# EAGLE design master_camera_io_2 (EAGLE 9.6.2)
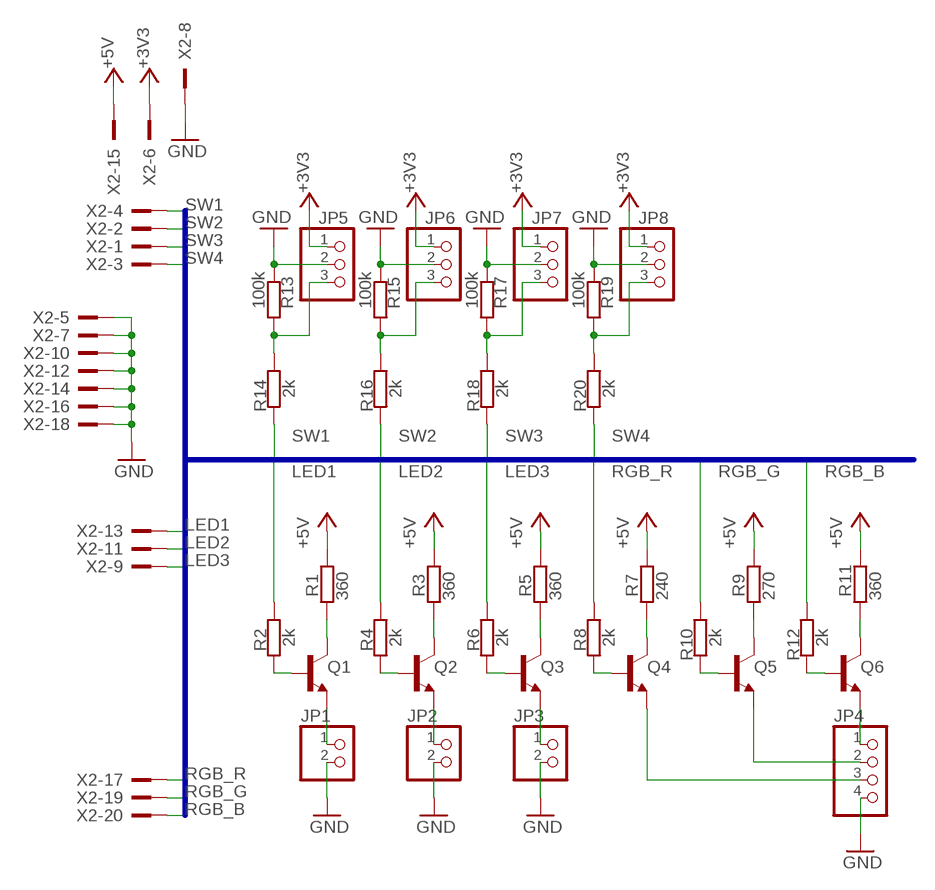
[diagram p0: schematic, sheet 1]

## Parts
JP1  PINHD-1X2  [1X02]
JP2  PINHD-1X2  [1X02]
JP3  PINHD-1X2  [1X02]
JP4  PINHD-1X4  [1X04]
JP5  PINHD-1X3  [1X03]
JP6  PINHD-1X3  [1X03]
JP7  PINHD-1X3  [1X03]
JP8  PINHD-1X3  [1X03]
Q1  BC850SMD  [SOT23-BEC]
Q2  BC850SMD  [SOT23-BEC]
Q3  BC850SMD  [SOT23-BEC]
Q4  BC850SMD  [SOT23-BEC]
Q5  BC850SMD  [SOT23-BEC]
Q6  BC850SMD  [SOT23-BEC]
R1  360  R-EU_R0805  [R0805]
R2  2k  R-EU_R0805  [R0805]
R3  360  R-EU_R0805  [R0805]
R4  2k  R-EU_R0805  [R0805]
R5  360  R-EU_R0805  [R0805]
R6  2k  R-EU_R0805  [R0805]
R7  240  R-EU_R0805  [R0805]
R8  2k  R-EU_R0805  [R0805]
R9  270  R-EU_R0805  [R0805]
R10  2k  R-EU_R0805  [R0805]
R11  360  R-EU_R0805  [R0805]
R12  2k  R-EU_R0805  [R0805]
R13  100k  R-EU_R0805  [R0805]
R14  2k  R-EU_R0805  [R0805]
R15  100k  R-EU_R0805  [R0805]
R16  2k  R-EU_R0805  [R0805]
R17  100k  R-EU_R0805  [R0805]
R18  2k  R-EU_R0805  [R0805]
R19  100k  R-EU_R0805  [R0805]
R20  2k  R-EU_R0805  [R0805]
X2  2520-  [PAK100/2500-20]

## Nets
+3V3: JP5.1 JP6.1 JP7.1 JP8.1 X2.6
+5V: R1.2 R3.2 R5.2 R7.2 R9.2 R11.2 X2.15
GND: JP1.2 JP2.2 JP3.2 JP4.4 JP5.2 JP6.2 JP7.2 JP8.2 R13.2 R15.2 R17.2 R19.2 X2.5 X2.7 X2.8 X2.10 X2.12 X2.14 X2.16 X2.18
LED1: R2.1 X2.13
LED2: R4.1 X2.11
LED3: R6.1 X2.9
N$1: JP1.1 Q1.E
N$2: Q1.B R2.2
N$3: Q1.C R1.1
N$4: JP2.1 Q2.E
N$5: Q2.B R4.2
N$6: Q2.C R3.1
N$7: JP3.1 Q3.E
N$8: Q3.B R6.2
N$9: Q3.C R5.1
N$10: JP4.1 Q6.E
N$11: Q4.B R8.2
N$12: Q4.C R7.1
N$13: JP4.2 Q5.E
N$14: Q5.B R10.2
N$15: Q5.C R9.1
N$16: JP4.3 Q4.E
N$17: Q6.B R12.2
N$18: Q6.C R11.1
N$19: JP5.3 R13.1 R14.1
N$20: JP6.3 R15.1 R16.1
N$21: JP7.3 R17.1 R18.1
N$22: JP8.3 R19.1 R20.1
RGB_B: R12.1 X2.20
RGB_G: R10.1 X2.19
RGB_R: R8.1 X2.17
SW1: R14.2 X2.4
SW2: R16.2 X2.2
SW3: R18.2 X2.1
SW4: R20.2 X2.3

## Buses
LED1,LED2,LED3,RGB_B,RGB_G,RGB_R,SW1,SW2,SW3,SW4

## Library data of the parts
JP1-JP3 = pinhead:PINHD-1X2: PIN HEADER
JP4 = pinhead:PINHD-1X4: PIN HEADER
JP5-JP8 = pinhead:PINHD-1X3: PIN HEADER
Q1-Q6 = transistor-npn:BC850*: NPN Transistor
R1-R20 = rcl:R-EU_: RESISTOR, European symbol; SPICEPREFIX: R
X2 = con-3m:2520-: 3M (TM) Pak 100 4-Wall Header Source: 3M; OC_FARNELL: unknown; OC_NEWARK: unknown

## Board
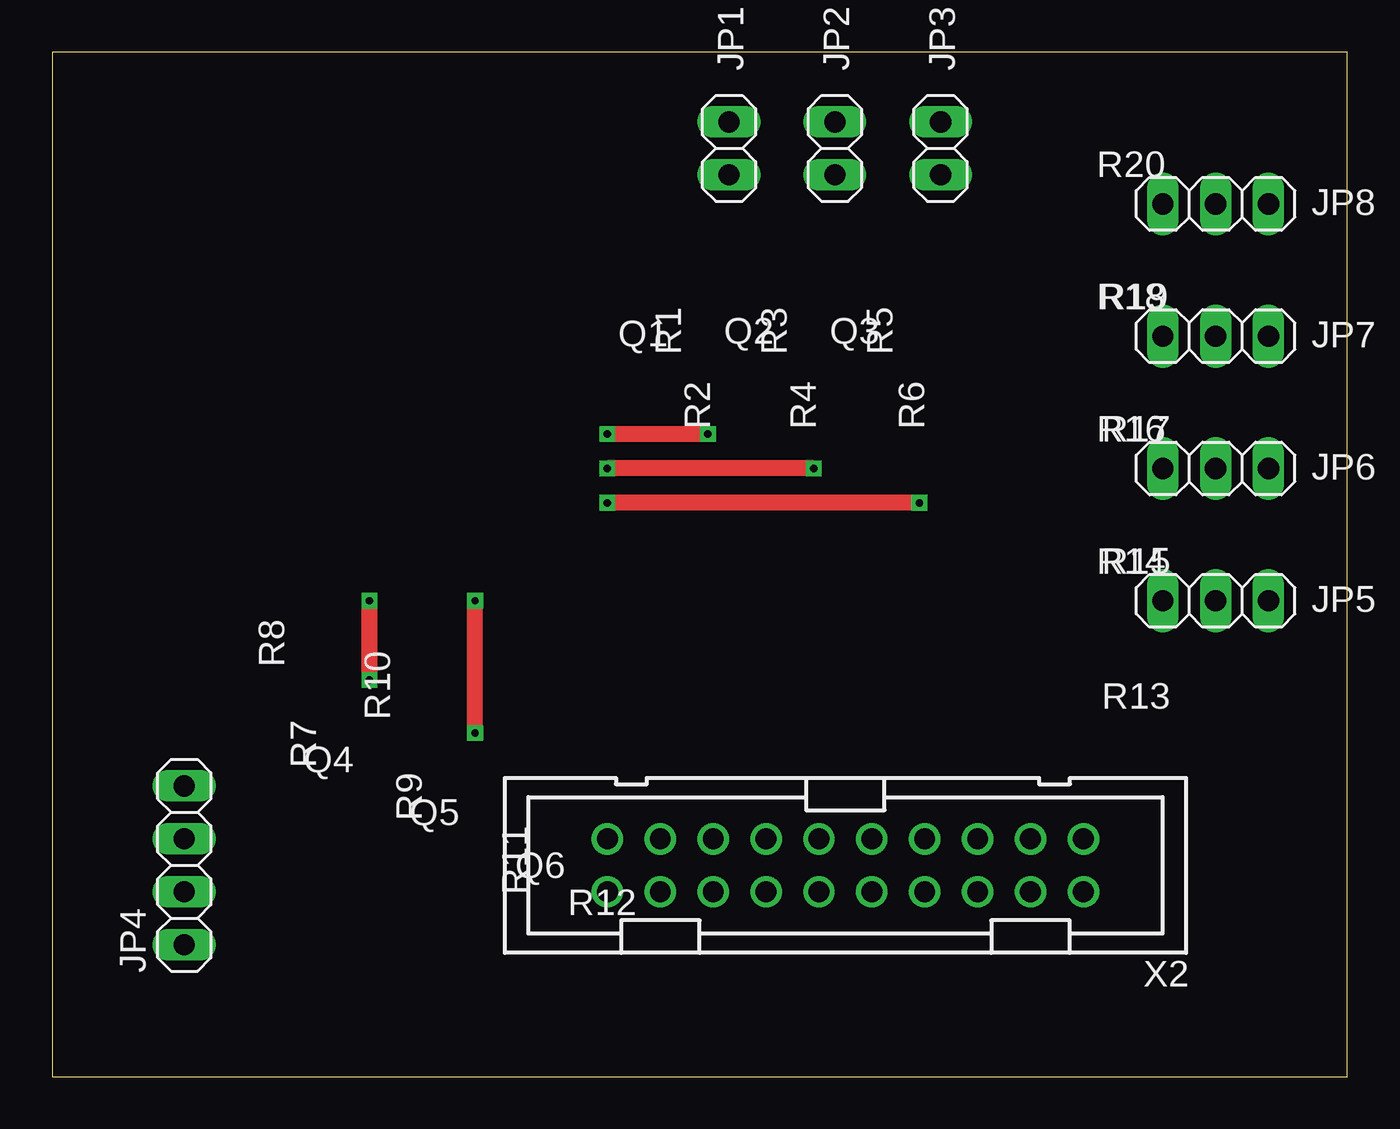
[diagram p1: board, top side]
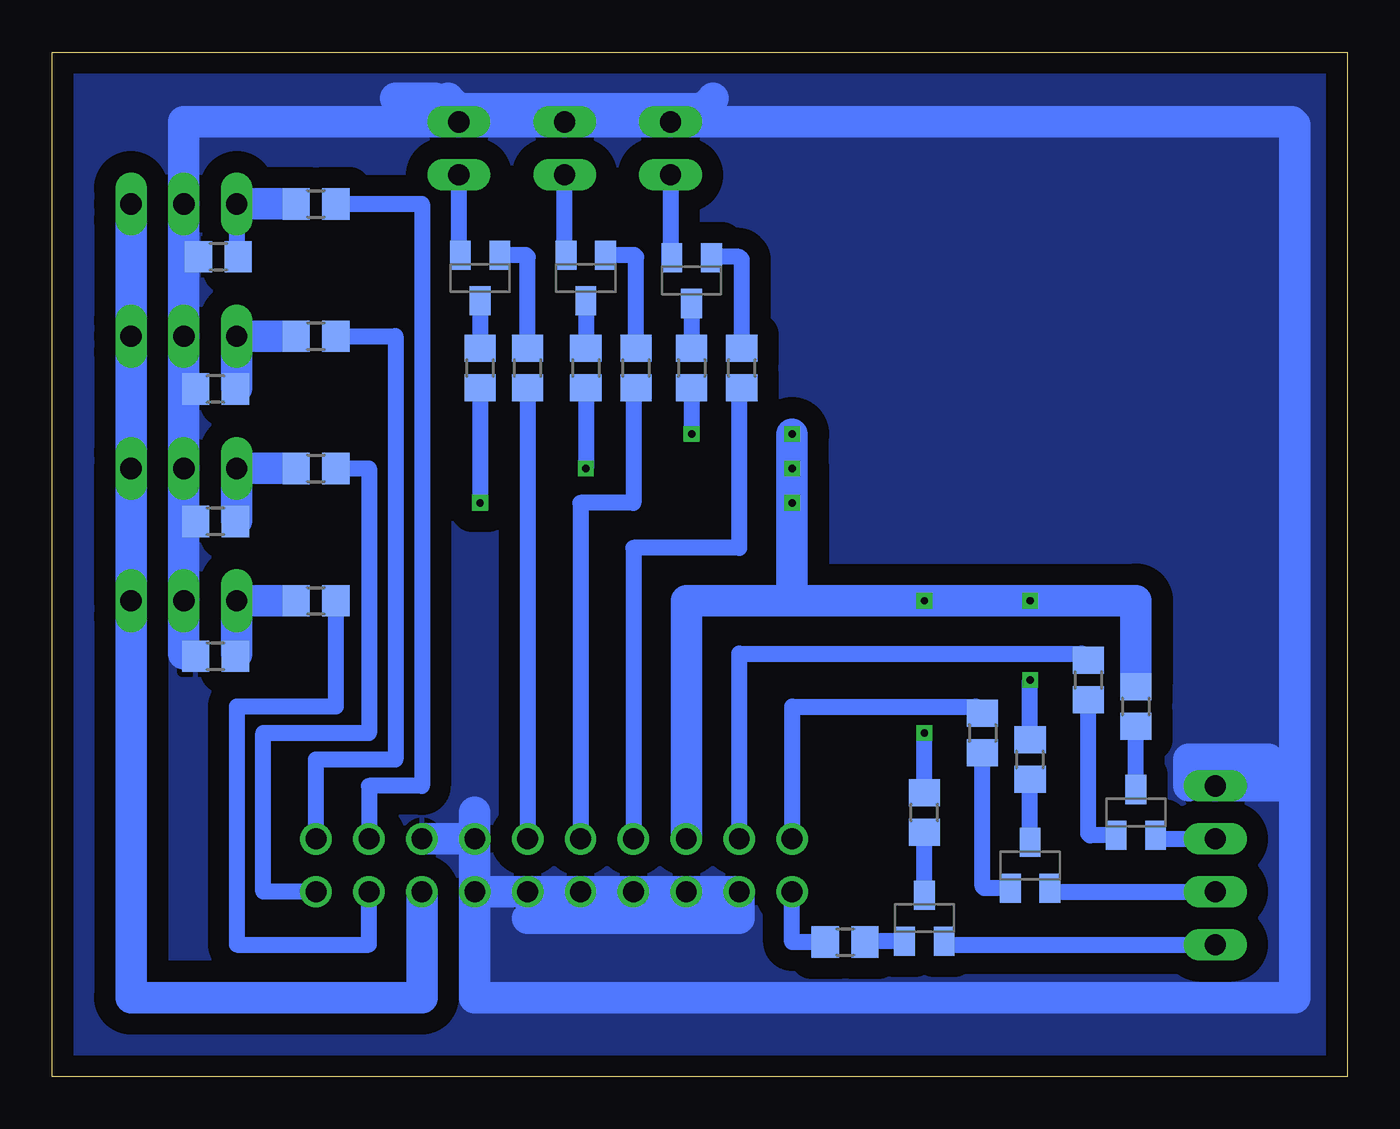
[diagram p2: board, bottom side, seen from below]

Size 62.21 x 49.2 mm. Coordinates in mm from the lower left corner, seen from the top.
Outline: 0,0 62.21,0 62.21,49.2 0,49.2 0,0
Copper layers (1*16): Top 0.035mm / dielectric 1.5mm / Bottom 0.035mm
Design rules "default": minimum track width 6mil, minimum drill 0.35mm, track to track 6mil, track to pad 6mil, pad to pad 6mil, via to via 6mil, smd to smd 6mil, copper to edge 40mil, drill to drill 6mil, minimum pad ring 10mil, minimum via ring 8mil, stop-mask expansion 4mil, vias tented up to drill 0mil, thermal gap 10mil

### Footprints (pad centres in the part's own frame; a part is rotated, then mirrored left to right if it is on the bottom)
1X02 = drill 1.016 long: 1 -1.27,0; 2 1.27,0
1X04 = drill 1.016 long: 1 -3.81,0; 2 -1.27,0; 3 1.27,0; 4 3.81,0
1X03 = drill 1.016 long: 1 -2.54,0; 2 0,0; 3 2.54,0
SOT23-BEC = smd 1 x 1.4: B -0.95,-1.1; C 0,1.1; E 0.95,-1.1
R0805 = smd 1.3 x 1.5: 1 -0.95,0; 2 0.95,0
PAK100/2500-20 = drill 1 pad 1.422: 1 -11.43,-1.27; 2 -11.43,1.27; 3 -8.89,-1.27; 4 -8.89,1.27; 5 -6.35,-1.27; 6 -6.35,1.27; 7 -3.81,-1.27; 8 -3.81,1.27; 9 -1.27,-1.27; 10 -1.27,1.27; 11 1.27,-1.27; 12 1.27,1.27; 13 3.81,-1.27; 14 3.81,1.27; 15 6.35,-1.27; 16 6.35,1.27; 17 8.89,-1.27; 18 8.89,1.27; 19 11.43,-1.27; 20 11.43,1.27

### Placement (x,y rotation side)
JP1  32.51,44.58 90 top
JP2  37.59,44.58 90 top
JP3  42.67,44.58 90 top
JP4  6.35,10.16 90 top
JP5  55.88,22.86 180 top
JP6  55.88,29.21 180 top
JP7  55.88,35.56 180 top
JP8  55.88,41.91 180 top
Q1  31.5,38.23 180 bottom
Q2  36.58,38.35 180 bottom
Q3  41.66,38.35 180 bottom
Q4  10.16,12.7 0 bottom
Q5  15.24,10.16 0 bottom
Q6  20.32,7.62 0 bottom
R1  31.5,34.04 270 bottom
R2  29.08,34.04 90 bottom
R3  36.58,34.04 270 bottom
R4  34.16,34.04 90 bottom
R5  41.66,34.04 270 bottom
R6  39.37,34.04 90 bottom
R7  10.16,17.78 90 bottom
R8  12.45,19.05 270 bottom
R9  15.24,15.24 90 bottom
R10  17.53,16.51 270 bottom
R11  20.32,12.7 90 bottom
R12  24.13,6.48 0 bottom
R13  54.36,20.19 180 bottom
R14  49.53,22.86 0 bottom
R15  54.36,26.67 180 bottom
R16  49.53,29.21 0 bottom
R17  54.36,33.02 180 bottom
R18  49.53,35.56 0 bottom
R19  54.23,39.37 180 bottom
R20  49.53,41.91 0 bottom
X2  38.1,10.16 180 top

### Tracks (layer width: path | path; a pad name or v marks a point on that pad's centre or on a via)
+3V3
  Bottom 1.524: JP8.1 JP7.1 JP6.1 JP5.1 58.42,3.81 44.45,3.81 X2.6
+5V  (via drill 0.35)
  Top 0.762: v15.24,19.05 v15.24,22.86 | v20.32,16.51 v20.32,22.86 | v31.5,30.86 v26.67,30.86 | v36.58,29.21 v26.67,29.21 | v41.66,27.56 v26.67,27.56
  Bottom 0.762: R1.2 v31.5,30.86 | 31.75,22.86 26.67,22.86 v20.32,22.86 v15.24,22.86 10.16,22.86 | 10.16,19.05 R7.2 | R11.2 v20.32,16.51 | R9.2 v15.24,19.05 | R3.2 v36.58,29.21 | R5.2 v41.66,27.56
  Bottom 1.524: X2.15 31.75,22.86 10.16,22.86 10.16,19.05 | v26.67,29.21 26.67,22.86 | v26.67,27.56 v26.67,29.21 | v26.67,29.21 v26.67,30.86
GND
  Bottom 0.762: R19.2 55.88,39.37 | R15.2 55.88,26.67 | R13.2 55.43,20.32 55.88,20.32 | R17.2 55.88,33.02
  Bottom 1.524: 55.88,20.32 JP5.2 55.88,26.67 JP6.2 55.88,33.02 JP7.2 55.88,39.37 JP8.2 55.88,45.85 JP3.2 | JP3.2 JP2.2 JP1.2 2.67,45.85 2.54,45.72 2.54,13.97 | 2.54,13.97 2.54,3.81 41.91,3.81 X2.8 | 2.54,13.97 JP4.4 6.35,15.24 | X2.5 X2.7 | X2.7 X2.8 | X2.8 X2.10 X2.12 X2.14 X2.16 X2.18 29.21,7.62 39.37,7.62 | X2.7 41.91,12.7 | JP3.2 42.67,46.48 | 43.18,46.99 42.67,46.48 | 42.67,46.48 30.99,46.48 30.48,46.99 | JP3.2 43.81,46.99 45.72,46.99 | 6.35,15.24 3.81,15.24 | 6.35,15.24 7.62,15.24 7.62,13.97
  pour Bottom (isolate 1.016): 0,49.53 62.23,49.53 62.23,0 0,0
LED1
  Bottom 0.762: R2.1 29.21,32.96 29.21,25.4 34.29,25.4 X2.13
LED2
  Bottom 0.762: R4.1 34.29,32.96 34.29,27.56 36.83,27.56 X2.11
LED3
  Bottom 0.762: R6.1 X2.9
N$1
  Bottom 0.762: JP1.1 32.51,39.39 Q1.E
N$2
  Bottom 0.762: R2.2 29.08,39.24 29.21,39.37 30.5,39.37 Q1.B
N$3
  Bottom 0.762: Q1.C R1.1
N$4
  Bottom 0.762: Q2.E 37.59,39.52 JP2.1
N$5
  Bottom 0.762: R4.2 34.16,39.37 34.25,39.45 Q2.B
N$6
  Bottom 0.762: Q2.C R3.1
N$7
  Bottom 0.762: Q3.E 42.67,39.52 JP3.1
N$8
  Bottom 0.762: R6.2 39.37,39.37 39.45,39.45 Q3.B
N$9
  Bottom 0.762: Q3.C R5.1
N$10
  Bottom 0.762: Q6.E 19.22,6.52 19.05,6.35 JP4.1
N$11
  Bottom 0.762: Q4.B 12.36,11.6 12.45,11.68 R8.2
N$12
  Bottom 0.762: Q4.C R7.1
N$13
  Bottom 0.762: Q5.E 14.14,9.06 13.97,8.89 JP4.2
N$14
  Bottom 0.762: Q5.B 17.44,9.06 17.53,9.14 R10.2
N$15
  Bottom 0.762: Q5.C R9.1
N$16
  Bottom 0.762: Q4.E 9.06,11.6 8.89,11.43 JP4.3
N$17
  Bottom 0.762: Q6.B 23.14,6.52 R12.2
N$18
  Bottom 0.762: Q6.C R11.1
N$19
  Bottom 0.762: 50.8,22.86 R14.1 | 53.28,22.8 JP5.3 | R13.1 53.34,20.26 53.34,20.32
  Bottom 1.524: 50.8,22.86 JP5.3 53.34,20.32
N$20
  Bottom 0.762: 50.8,29.21 R16.1 | 53.34,26.74 R15.1
  Bottom 1.524: 50.8,29.21 JP6.3 53.34,26.74
N$21
  Bottom 0.762: 50.8,35.56 R18.1 | 53.34,33.09 R17.1
  Bottom 1.524: 50.8,35.56 JP7.3 53.34,33.09
N$22
  Bottom 0.762: JP8.3 53.34,39.43 R19.1 | 50.8,41.91 R20.1
  Bottom 1.524: JP8.3 50.8,41.91
RGB_B
  Bottom 0.762: R12.1 26.67,6.48 X2.20
RGB_G
  Bottom 0.762: R10.1 17.85,17.78 26.67,17.78 X2.19
RGB_R
  Bottom 0.762: R8.1 12.77,20.32 29.21,20.32 X2.17
SW1
  Bottom 0.762: R14.2 48.58,17.78 53.34,17.78 53.34,6.35 46.99,6.35 X2.4
SW2
  Bottom 0.762: R16.2 46.99,29.21 46.99,16.51 52.07,16.51 52.07,8.89 X2.2
SW3
  Bottom 0.762: R18.2 45.72,35.56 45.72,15.24 49.53,15.24 X2.1
SW4
  Bottom 0.762: R20.2 44.45,41.91 44.45,13.97 46.99,13.97 X2.3